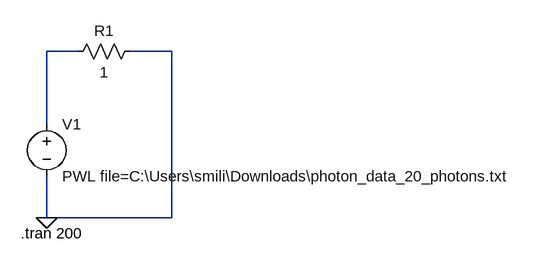
[diagram p0: schematic test_pwl.asc]
test_pwl.asc, the LTspice schematic file:
Version 4
SHEET 1 888 680
WIRE 128 16 80 16
WIRE 272 16 208 16
WIRE 80 128 80 16
WIRE 80 272 80 208
WIRE 272 272 272 16
WIRE 272 272 80 272
FLAG 80 272 0
SYMBOL voltage 80 112 R0
WINDOW 123 0 0 Left 0
WINDOW 39 0 0 Left 0
SYMATTR InstName V1
SYMATTR Value PWL file=C:\Users\smili\Downloads\photon_data_20_photons.txt
SYMBOL res 224 0 R90
WINDOW 0 0 56 VBottom 2
WINDOW 3 32 56 VTop 2
SYMATTR InstName R1
SYMATTR Value 1
TEXT 40 296 Left 2 !.tran 200

The netlist it stands for:
* test_pwl.asc
V1 N001 0 PWL file=C:\Users\smili\Downloads\photon_data_20_photons.txt
R1 0 N001 1
.tran 200
.backanno
.end